# EAGLE design pH_Arduino (EAGLE 5.11)
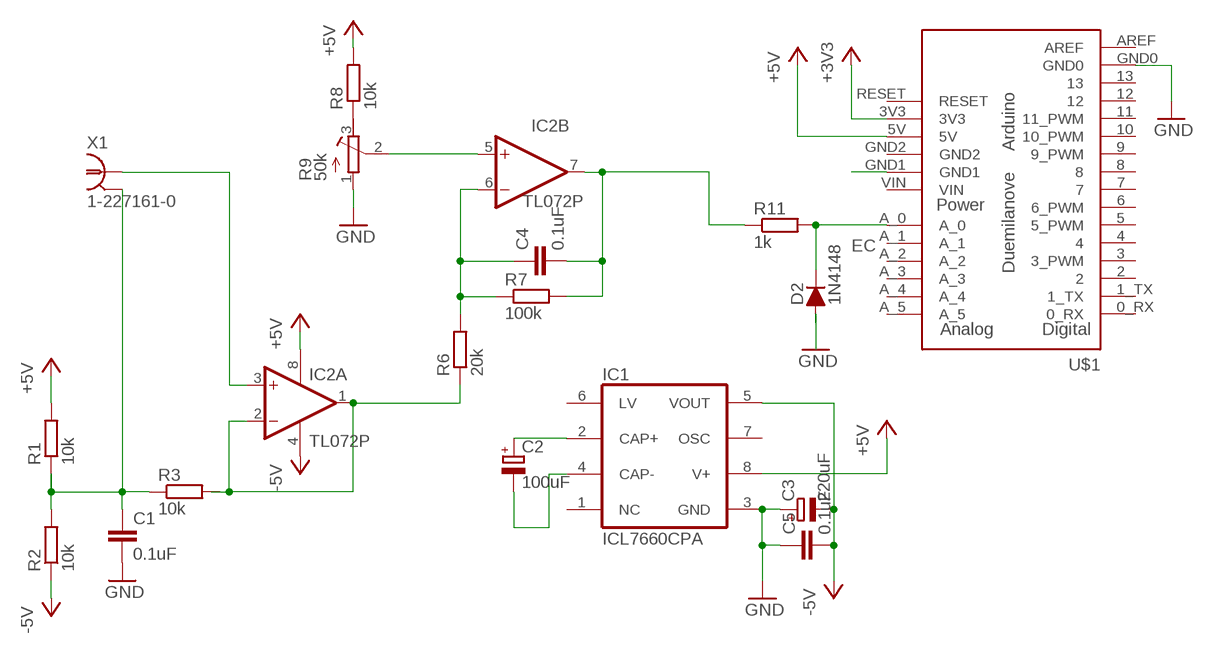
[diagram p0: schematic, sheet 1]

## Parts
C1  0.1uF  C2.5/2  [C2.5-2]
C2  100uF  CPOL-EUE2.5-5  [E2,5-5]
C3  220uF  CPOL-EUE2,5-6E  [E2,5-6E]
C4  0.1uF  C2.5/2  [C2.5-2]
C5  0.1uF  C2.5/2  [C2.5-2]
D2  1N4148  1N4148PH  [DO35-7]
IC1  ICL7660CPA  [DIL08]
IC2  TL072P  [DIL08]
R1  10k  R-EU_0204/5  [0204/5]
R2  10k  R-EU_0204/5  [0204/5]
R3  10k  R-EU_0204/5  [0204/5]
R6  20k  R-EU_0204/5  [0204/5]
R7  100k  R-EU_0204/5  [0204/5]
R8  10k  R-EU_0204/5  [0204/5]
R9  50k  R-TRIMM64X  [RTRIM64X]
R11  1k  R-EU_0204/5  [0204/5]
U$1  ARDUINO-USBOCTAGONAL_PADS  [SHIELD-OCTAGONALPAD]
X1  1-227161-0  [AMP_227161]

## Nets
+3V3: U$1.3V3
+5V: IC1.8(V+) IC2.8(P:V+) R1.2 R8.2 U$1.5V
-5V: C3.- C5.2 IC1.5(VOUT) IC2.4(P:V-) R2.1
EC: D2.C R11.2 U$1.A_0
GND: C1.2 C3.+ C5.1 IC1.3(GND) R9.1(E) U$1.GND0
GND1: U$1.GND1
N$1: C1.1 R1.1 R2.2 R3.1 X1.2(GND)
N$3: C2.- IC1.4(CAP-)
N$4: IC2.3(A:+IN) X1.1
N$5: R8.1 R9.3(A)
N$6: D2.A
N$7: C4.2 IC2.7(B:OUT) R7.2 R11.1
N$10: C2.+ IC1.2(CAP+)
N$11: C4.1 IC2.6(B:-IN) R6.2 R7.1
N$12: IC2.1(A:OUT) IC2.2(A:-IN) R3.2 R6.1
VREF: IC2.5(B:+IN) R9.2(S)
Unconnected: IC1.1(NC) IC1.6(LV) IC1.7(OSC) U$1.0_RX U$1.1_TX U$1.2 U$1.3(3_PWM) U$1.4 U$1.5(5_PWM) U$1.6(6_PWM) U$1.7 U$1.8 U$1.9(9_PWM) U$1.10(10_PWM) U$1.11(11_PWM) U$1.12 U$1.13 U$1.A_1 U$1.A_2 U$1.A_3 U$1.A_4 U$1.A_5 U$1.AREF U$1.GND2 U$1.RESET

## Power pins joined to a net without a drawn wire
VIN: U$1.VIN

## Library data of the parts
C1 C4 C5 = capacitor-wima:C: CAPACITOR naming: grid - package width
C2 C3 = resistor:CPOL-EU: POLARIZED CAPACITOR, European symbol
D2 = JPN:1N4148: DIODE high speed (Philips)
IC1 = maxim:ICL7660CPA: VOLTAGE CONVERTER
IC2 = linear:TL072: OP AMP
R1-R3 R6-R8 R11 = rcl:R-EU_: RESISTOR, European symbol
R9 = resistor:R-TRIMM: Trimm resistor
U$1 = Arduino-Various:ARDUINO-USB: The Ardiuno Duemilanove Pinouts layoutet as a Bare Shield. v0.5 Also for Arduino Diecimila. This is designed as a Part and has no Outline in the Dimension Layer. The Outline, when present, is drawed at the tPlace / bPlace Layer. Library by Stephanie Lange, http://www.k-ita.de/~sl/
X1 = con-coax:?227161*: JACK, RIGHT ANGLE, 50 OHM, PCB, BNC Source: amp_227161.pdf

## Board
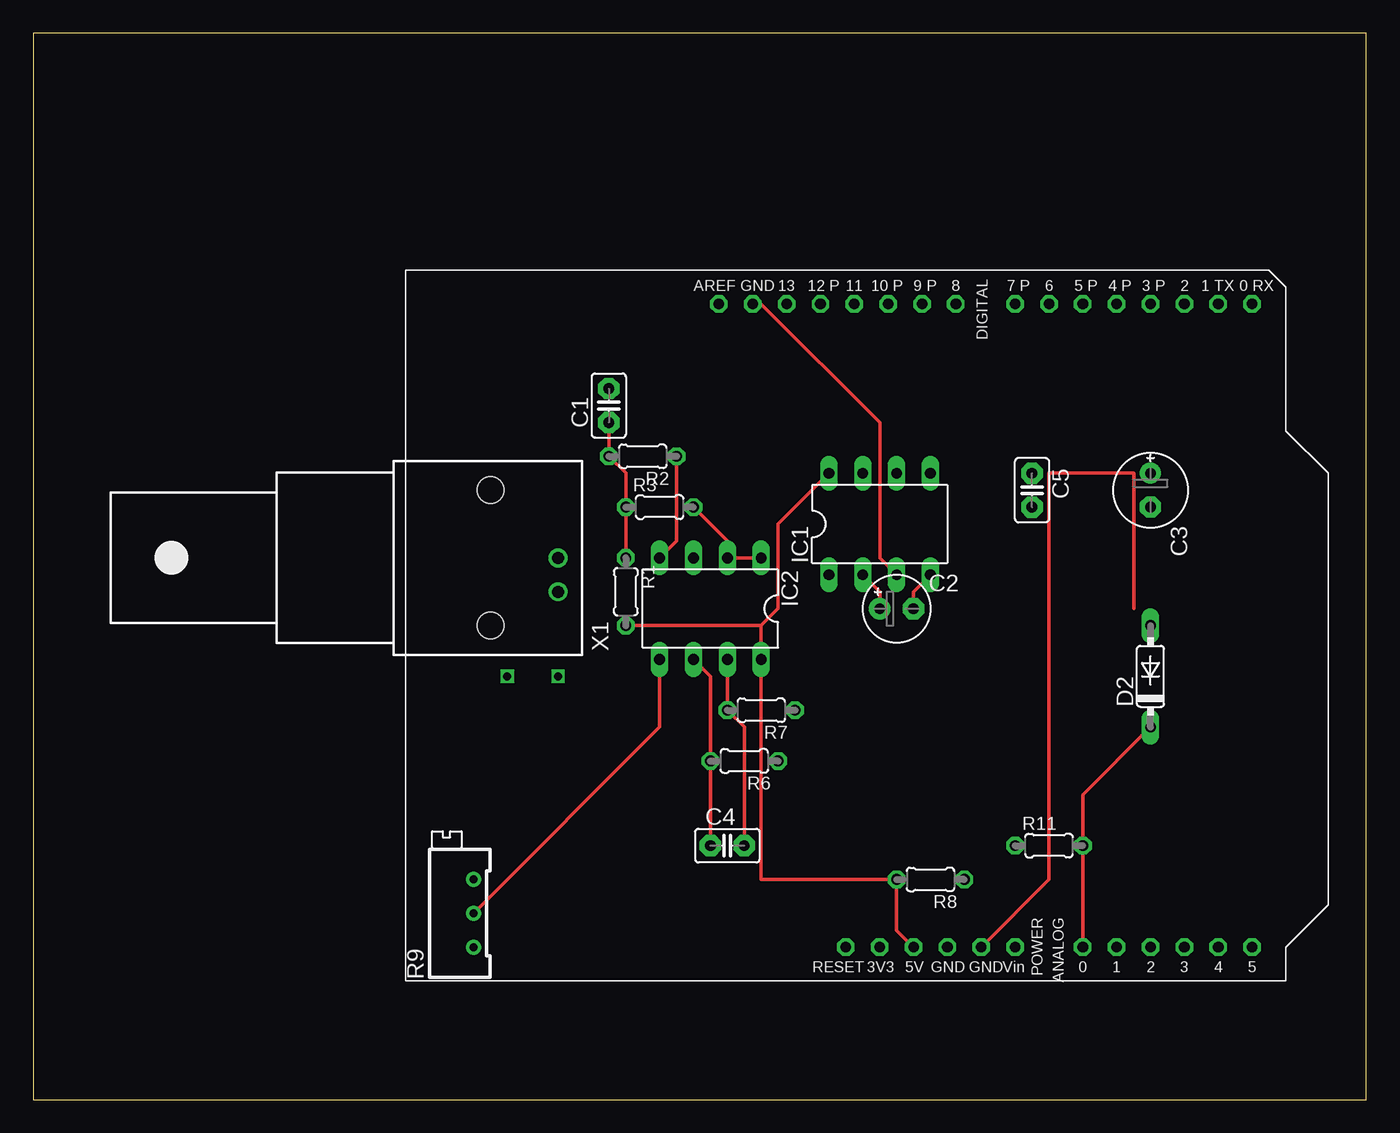
[diagram p1: board, top side]
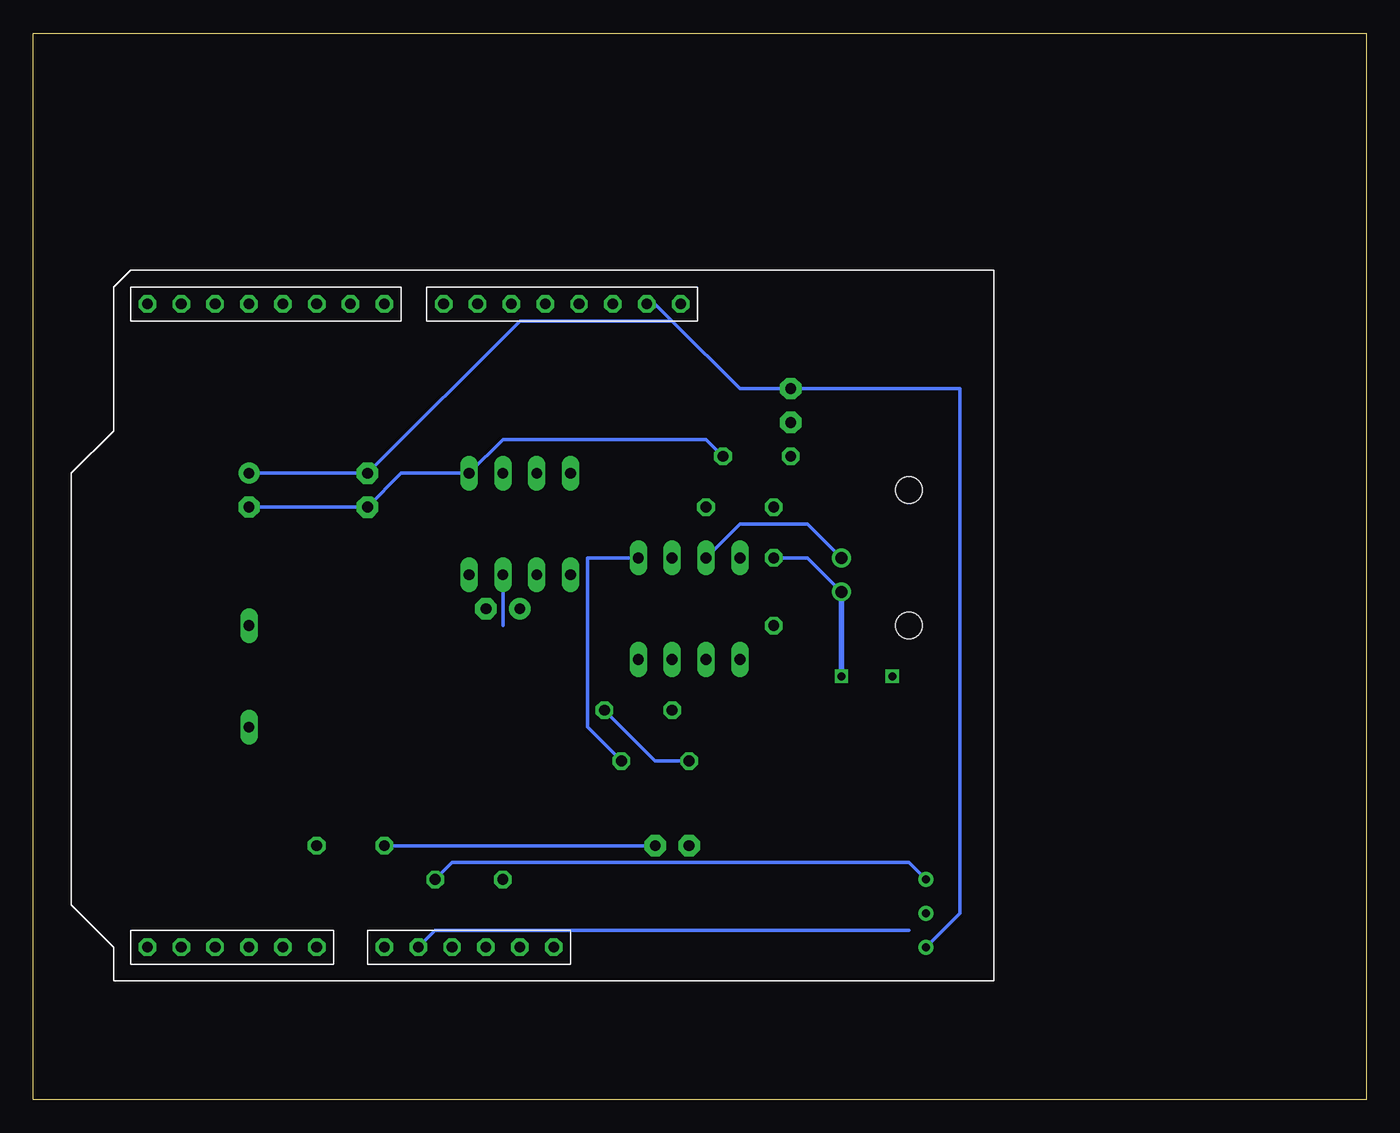
[diagram p2: board, bottom side, seen from below]

Size 100 x 80 mm. Coordinates in mm from the lower left corner, seen from the top.
Outline: 0,0 100,0 100,80 0,80 0,0
Copper layers (1*16): Top 0.035mm / dielectric 1.5mm / Bottom 0.035mm
Design rules "default": minimum track width 10mil, minimum drill 24mil, track to track 8mil, track to pad 8mil, pad to pad 8mil, via to via 8mil, smd to smd 8mil, copper to edge 40mil, drill to drill 8mil, minimum pad ring 10mil, minimum via ring 8mil, stop-mask expansion 4mil, vias tented up to drill 0mil, thermal gap 10mil

### Footprints (pad centres in the part's own frame; a part is rotated, then mirrored left to right if it is on the bottom)
C2.5-2 = drill 0.813 pad 1.6 octagon: 1 -1.27,0; 2 1.27,0
E2,5-5 = drill 0.813 pad 1.6 round: + -1.27,0 | drill 0.813 pad 1.6 octagon: - 1.27,0
E2,5-6E = drill 0.813 pad 1.575 round: + -1.27,0 | drill 0.813 pad 1.575 octagon: - 1.27,0
DO35-7 = drill 0.813 long: A 3.81,0; C -3.81,0
DIL08 = drill 0.813 long: 1 -3.81,-3.81; 2 -1.27,-3.81; 3 1.27,-3.81; 4 3.81,-3.81; 5 3.81,3.81; 6 1.27,3.81; 7 -1.27,3.81; 8 -3.81,3.81
0204/5 = drill 0.813 octagon: 1 -2.54,0; 2 2.54,0
RTRIM64X = drill 0.61 round: 1 1.27,-2.54; 2 1.27,0; 3 1.27,2.54
SHIELD-OCTAGONALPAD = drill 0.8 pad 1.27 octagon: 0_RX -25.4,27.94; 1_TX -25.4,25.4; 2 -25.4,22.86; 3 -25.4,20.32; 3V3 22.86,0; 4 -25.4,17.78; 5 -25.4,15.24; 5V 22.86,2.54; 6 -25.4,12.7; 7 -25.4,10.16; 8 -25.4,5.715; 9 -25.4,3.175; 10 -25.4,0.635; 11 -25.4,-1.905; 12 -25.4,-4.445; 13 -25.4,-6.985; A_0 22.86,15.24; A_1 22.86,17.78; A_2 22.86,20.32; A_3 22.86,22.86; A_4 22.86,25.4; A_5 22.86,27.94; AREF -25.4,-12.065; GND0 -25.4,-9.525; GND1 22.86,7.62; GND2 22.86,5.08; RESET 22.86,-2.54; VIN 22.86,10.16
AMP_227161 = drill 0.9 pad 1.27 round: 1 0,-5.08; 2 -2.54,-5.08 | hole 2: -5.08,0; 5.08,0

### Placement (x,y rotation side)
C1  43.18,52.07 90 top
C2  64.77,36.83 0 top
C3  83.82,45.72 270 top
C4  52.07,19.05 0 top
C5  74.93,45.72 270 top
D2  83.82,31.75 90 top
IC1  63.5,43.18 0 top
IC2  50.8,36.83 180 top
R1  44.45,38.1 270 top
R2  45.72,48.26 180 top
R3  46.99,44.45 0 top
R6  53.34,25.4 180 top
R7  54.61,29.21 180 top
R8  67.31,16.51 180 top
R9  31.75,13.97 0 top
R11  76.2,19.05 0 top
U$1  63.5,34.29 270 top
X1  34.29,40.64 90 top

### Tracks (layer width: path | path; a pad name or v marks a point on that pad's centre or on a via)
+5V
  Top 0.254: 54.61,35.56 R1.2 | 54.61,35.56 IC2.8 54.61,16.51 R8.2 64.77,12.7 U$1.5V | IC1.8 55.88,43.18 55.88,36.83 54.61,35.56
-5V
  Top 0.254: IC2.4 48.26,41.91 R2.1
  Bottom 0.254: R2.1 49.53,49.53 64.77,49.53 IC1.5 72.39,46.99 C5.2 C3.-
EC
  Top 0.254: U$1.A_0 R11.2 78.74,22.86 D2.C
GND
  Top 0.254: U$1.GND0 54.61,59.69 63.5,50.8 63.5,40.64 IC1.3
  Bottom 0.254: IC1.3 64.77,35.56 | 52.07,58.42 46.99,53.34 C1.2 30.48,53.34 30.48,13.97 R9.1 | 52.07,58.42 53.34,59.69 U$1.GND0 | C3.+ C5.1 63.5,58.42 52.07,58.42
GND1
  Top 0.254: 82.55,36.83 82.55,46.99 76.2,46.99 76.2,16.51 U$1.GND1
  Bottom 0.254: 34.29,12.7 69.85,12.7 U$1.GND1
N$1  (via drill 0.6)
  Top 0.254: C1.1 R2.2 44.45,46.99 R3.1 R1.1
  Bottom 0.254: X1.2 41.91,40.64 R1.1
  Bottom 0.406: v39.37,31.75 X1.2
N$3
  Top 0.254: IC1.4 66.04,38.1 C2.-
N$4
  Bottom 0.254: IC2.3 46.99,43.18 41.91,43.18 X1.1
N$5
  Bottom 0.254: R9.3 34.29,17.78 68.58,17.78 R8.1
N$7
  Top 0.254: IC2.7 R7.2 53.34,27.94 C4.2
  Bottom 0.254: C4.2 R11.1
N$9  (via drill 0.6)
  other vias: 35.56,31.75
N$10
  Top 0.254: IC1.2 63.5,38.1 C2.+
N$11
  Top 0.254: IC2.6 50.8,31.75 R6.2 C4.1
  Bottom 0.254: R7.1 53.34,25.4 R6.2
N$12
  Top 0.254: IC2.2 52.07,41.91 | 52.07,41.91 R3.2 | IC2.2 52.07,41.91 | IC2.1 IC2.2
  Bottom 0.254: R6.1 58.42,27.94 58.42,40.64 IC2.1
VREF
  Top 0.254: IC2.5 46.99,27.94 R9.2